# Altium schematic sheet OB_BANK.SchDoc
size 508 x 254 mm; DocumentNumber: 8; SheetNumber: 8; SheetTotal: 13
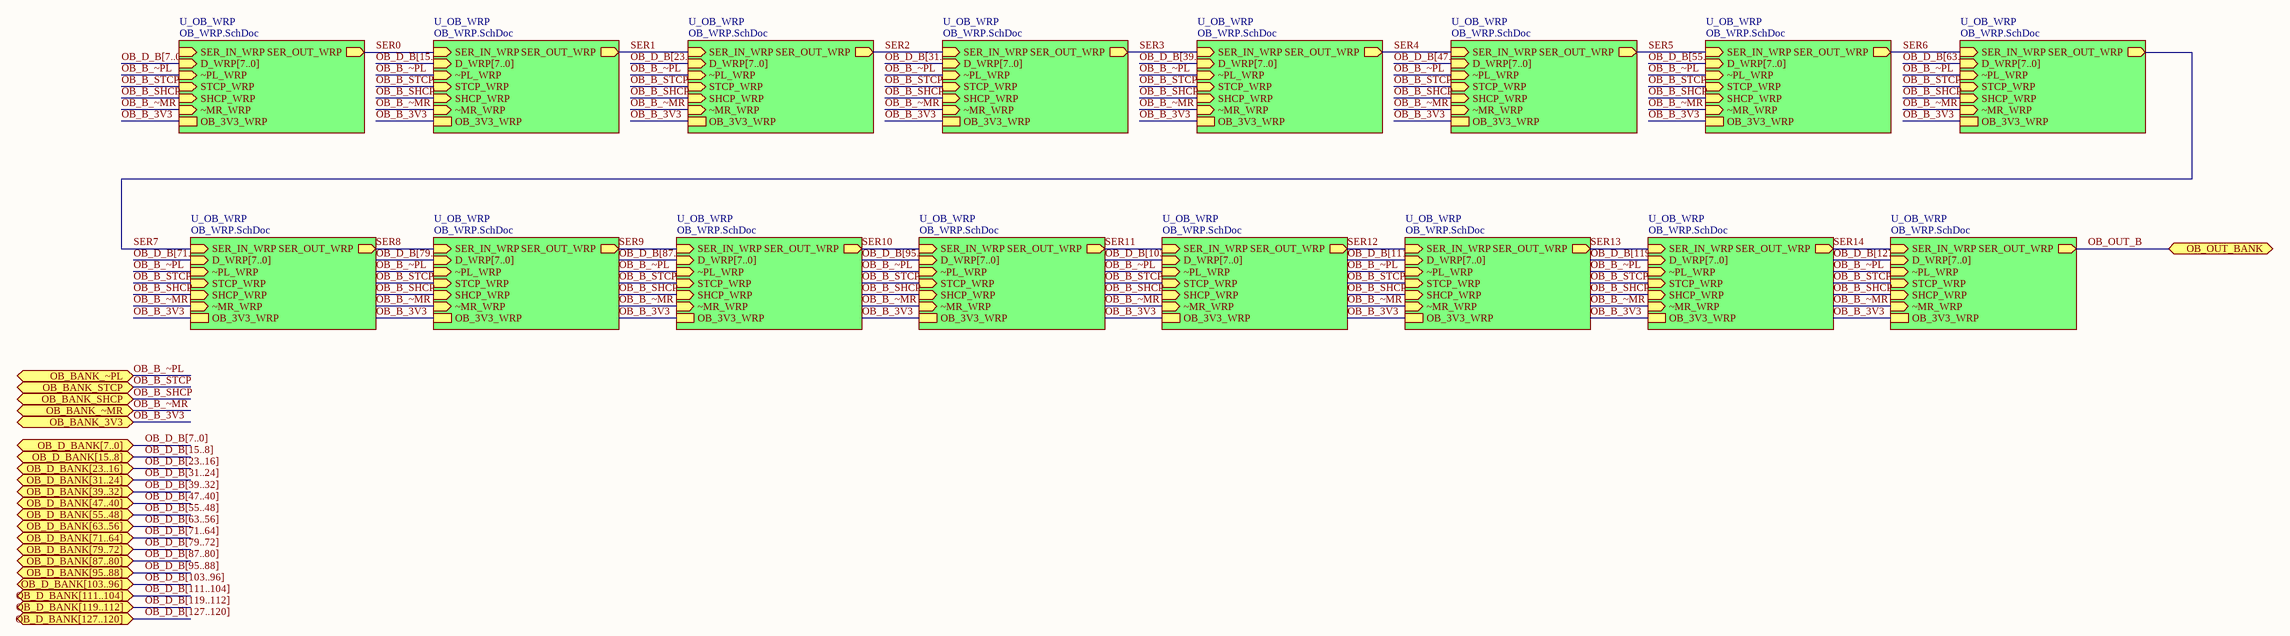
[diagram p0: OB_BANK.SchDoc]

## Sub-sheets
U_OB_WRP = OB_WRP.SchDoc: D_WRP[7..0], SER_OUT_WRP, SER_IN_WRP, ~PL_WRP, STCP_WRP, SHCP_WRP, ~MR_WRP, OB_3V3_WRP
U_OB_WRP = OB_WRP.SchDoc: D_WRP[7..0], SER_OUT_WRP, SER_IN_WRP, ~PL_WRP, STCP_WRP, SHCP_WRP, ~MR_WRP, OB_3V3_WRP
U_OB_WRP = OB_WRP.SchDoc: D_WRP[7..0], SER_OUT_WRP, SER_IN_WRP, ~PL_WRP, STCP_WRP, SHCP_WRP, ~MR_WRP, OB_3V3_WRP
U_OB_WRP = OB_WRP.SchDoc: D_WRP[7..0], SER_OUT_WRP, SER_IN_WRP, ~PL_WRP, STCP_WRP, SHCP_WRP, ~MR_WRP, OB_3V3_WRP
U_OB_WRP = OB_WRP.SchDoc: D_WRP[7..0], SER_OUT_WRP, SER_IN_WRP, ~PL_WRP, STCP_WRP, SHCP_WRP, ~MR_WRP, OB_3V3_WRP
U_OB_WRP = OB_WRP.SchDoc: D_WRP[7..0], SER_OUT_WRP, SER_IN_WRP, ~PL_WRP, STCP_WRP, SHCP_WRP, ~MR_WRP, OB_3V3_WRP
U_OB_WRP = OB_WRP.SchDoc: D_WRP[7..0], SER_OUT_WRP, SER_IN_WRP, ~PL_WRP, STCP_WRP, SHCP_WRP, ~MR_WRP, OB_3V3_WRP
U_OB_WRP = OB_WRP.SchDoc: D_WRP[7..0], SER_OUT_WRP, SER_IN_WRP, ~PL_WRP, STCP_WRP, SHCP_WRP, ~MR_WRP, OB_3V3_WRP
U_OB_WRP = OB_WRP.SchDoc: D_WRP[7..0], SER_OUT_WRP, SER_IN_WRP, ~PL_WRP, STCP_WRP, SHCP_WRP, ~MR_WRP, OB_3V3_WRP
U_OB_WRP = OB_WRP.SchDoc: D_WRP[7..0], SER_OUT_WRP, SER_IN_WRP, ~PL_WRP, STCP_WRP, SHCP_WRP, ~MR_WRP, OB_3V3_WRP
U_OB_WRP = OB_WRP.SchDoc: D_WRP[7..0], SER_OUT_WRP, SER_IN_WRP, ~PL_WRP, STCP_WRP, SHCP_WRP, ~MR_WRP, OB_3V3_WRP
U_OB_WRP = OB_WRP.SchDoc: D_WRP[7..0], SER_OUT_WRP, SER_IN_WRP, ~PL_WRP, STCP_WRP, SHCP_WRP, ~MR_WRP, OB_3V3_WRP
U_OB_WRP = OB_WRP.SchDoc: D_WRP[7..0], SER_OUT_WRP, SER_IN_WRP, ~PL_WRP, STCP_WRP, SHCP_WRP, ~MR_WRP, OB_3V3_WRP
U_OB_WRP = OB_WRP.SchDoc: D_WRP[7..0], SER_OUT_WRP, SER_IN_WRP, ~PL_WRP, STCP_WRP, SHCP_WRP, ~MR_WRP, OB_3V3_WRP
U_OB_WRP = OB_WRP.SchDoc: D_WRP[7..0], SER_OUT_WRP, SER_IN_WRP, ~PL_WRP, STCP_WRP, SHCP_WRP, ~MR_WRP, OB_3V3_WRP
U_OB_WRP = OB_WRP.SchDoc: D_WRP[7..0], SER_OUT_WRP, SER_IN_WRP, ~PL_WRP, STCP_WRP, SHCP_WRP, ~MR_WRP, OB_3V3_WRP

## Ports
OB_BANK_3V3, OB_BANK_SHCP, OB_BANK_STCP, OB_BANK_~MR, OB_BANK_~PL, OB_D_BANK[7..0], OB_D_BANK[15..8], OB_D_BANK[23..16], OB_D_BANK[31..24], OB_D_BANK[39..32], OB_D_BANK[47..40], OB_D_BANK[55..48], OB_D_BANK[63..56], OB_D_BANK[71..64], OB_D_BANK[79..72], OB_D_BANK[87..80], OB_D_BANK[95..88], OB_D_BANK[103..96], OB_D_BANK[111..104], OB_D_BANK[119..112], OB_D_BANK[127..120], OB_OUT_BANK

## Nets
OB_B_3V3: port OB_BANK_3V3, sheet U_OB_WRP/OB_3V3_WRP, sheet U_OB_WRP/OB_3V3_WRP, sheet U_OB_WRP/OB_3V3_WRP, sheet U_OB_WRP/OB_3V3_WRP, sheet U_OB_WRP/OB_3V3_WRP, sheet U_OB_WRP/OB_3V3_WRP, sheet U_OB_WRP/OB_3V3_WRP, sheet U_OB_WRP/OB_3V3_WRP, sheet U_OB_WRP/OB_3V3_WRP, sheet U_OB_WRP/OB_3V3_WRP, sheet U_OB_WRP/OB_3V3_WRP, sheet U_OB_WRP/OB_3V3_WRP, sheet U_OB_WRP/OB_3V3_WRP, sheet U_OB_WRP/OB_3V3_WRP, sheet U_OB_WRP/OB_3V3_WRP, sheet U_OB_WRP/OB_3V3_WRP
OB_B_SHCP: port OB_BANK_SHCP, sheet U_OB_WRP/SHCP_WRP, sheet U_OB_WRP/SHCP_WRP, sheet U_OB_WRP/SHCP_WRP, sheet U_OB_WRP/SHCP_WRP, sheet U_OB_WRP/SHCP_WRP, sheet U_OB_WRP/SHCP_WRP, sheet U_OB_WRP/SHCP_WRP, sheet U_OB_WRP/SHCP_WRP, sheet U_OB_WRP/SHCP_WRP, sheet U_OB_WRP/SHCP_WRP, sheet U_OB_WRP/SHCP_WRP, sheet U_OB_WRP/SHCP_WRP, sheet U_OB_WRP/SHCP_WRP, sheet U_OB_WRP/SHCP_WRP, sheet U_OB_WRP/SHCP_WRP, sheet U_OB_WRP/SHCP_WRP
OB_B_STCP: port OB_BANK_STCP, sheet U_OB_WRP/STCP_WRP, sheet U_OB_WRP/STCP_WRP, sheet U_OB_WRP/STCP_WRP, sheet U_OB_WRP/STCP_WRP, sheet U_OB_WRP/STCP_WRP, sheet U_OB_WRP/STCP_WRP, sheet U_OB_WRP/STCP_WRP, sheet U_OB_WRP/STCP_WRP, sheet U_OB_WRP/STCP_WRP, sheet U_OB_WRP/STCP_WRP, sheet U_OB_WRP/STCP_WRP, sheet U_OB_WRP/STCP_WRP, sheet U_OB_WRP/STCP_WRP, sheet U_OB_WRP/STCP_WRP, sheet U_OB_WRP/STCP_WRP, sheet U_OB_WRP/STCP_WRP
OB_B_~MR: port OB_BANK_~MR, sheet U_OB_WRP/~MR_WRP, sheet U_OB_WRP/~MR_WRP, sheet U_OB_WRP/~MR_WRP, sheet U_OB_WRP/~MR_WRP, sheet U_OB_WRP/~MR_WRP, sheet U_OB_WRP/~MR_WRP, sheet U_OB_WRP/~MR_WRP, sheet U_OB_WRP/~MR_WRP, sheet U_OB_WRP/~MR_WRP, sheet U_OB_WRP/~MR_WRP, sheet U_OB_WRP/~MR_WRP, sheet U_OB_WRP/~MR_WRP, sheet U_OB_WRP/~MR_WRP, sheet U_OB_WRP/~MR_WRP, sheet U_OB_WRP/~MR_WRP, sheet U_OB_WRP/~MR_WRP
OB_B_~PL: port OB_BANK_~PL, sheet U_OB_WRP/~PL_WRP, sheet U_OB_WRP/~PL_WRP, sheet U_OB_WRP/~PL_WRP, sheet U_OB_WRP/~PL_WRP, sheet U_OB_WRP/~PL_WRP, sheet U_OB_WRP/~PL_WRP, sheet U_OB_WRP/~PL_WRP, sheet U_OB_WRP/~PL_WRP, sheet U_OB_WRP/~PL_WRP, sheet U_OB_WRP/~PL_WRP, sheet U_OB_WRP/~PL_WRP, sheet U_OB_WRP/~PL_WRP, sheet U_OB_WRP/~PL_WRP, sheet U_OB_WRP/~PL_WRP, sheet U_OB_WRP/~PL_WRP, sheet U_OB_WRP/~PL_WRP
OB_OUT_B: port OB_OUT_BANK, sheet U_OB_WRP/SER_OUT_WRP
SER0: sheet U_OB_WRP/SER_OUT_WRP, sheet U_OB_WRP/SER_IN_WRP
SER1: sheet U_OB_WRP/SER_OUT_WRP, sheet U_OB_WRP/SER_IN_WRP
SER2: sheet U_OB_WRP/SER_OUT_WRP, sheet U_OB_WRP/SER_IN_WRP
SER3: sheet U_OB_WRP/SER_OUT_WRP, sheet U_OB_WRP/SER_IN_WRP
SER4: sheet U_OB_WRP/SER_OUT_WRP, sheet U_OB_WRP/SER_IN_WRP
SER5: sheet U_OB_WRP/SER_OUT_WRP, sheet U_OB_WRP/SER_IN_WRP
SER6: sheet U_OB_WRP/SER_OUT_WRP, sheet U_OB_WRP/SER_IN_WRP
SER7: sheet U_OB_WRP/SER_OUT_WRP, sheet U_OB_WRP/SER_IN_WRP
SER8: sheet U_OB_WRP/SER_OUT_WRP, sheet U_OB_WRP/SER_IN_WRP
SER9: sheet U_OB_WRP/SER_OUT_WRP, sheet U_OB_WRP/SER_IN_WRP
SER10: sheet U_OB_WRP/SER_OUT_WRP, sheet U_OB_WRP/SER_IN_WRP
SER11: sheet U_OB_WRP/SER_OUT_WRP, sheet U_OB_WRP/SER_IN_WRP
SER12: sheet U_OB_WRP/SER_OUT_WRP, sheet U_OB_WRP/SER_IN_WRP
SER13: sheet U_OB_WRP/SER_OUT_WRP, sheet U_OB_WRP/SER_IN_WRP
SER14: sheet U_OB_WRP/SER_OUT_WRP, sheet U_OB_WRP/SER_IN_WRP

## Buses and harness runs
bus OB_D_B[7..0] = port OB_D_BANK[7..0]
bus OB_D_B[7..0] = sheet U_OB_WRP/D_WRP[7..0]
bus OB_D_B[15..8] = port OB_D_BANK[15..8]
bus OB_D_B[15..8] = sheet U_OB_WRP/D_WRP[7..0]
bus OB_D_B[23..16] = port OB_D_BANK[23..16]
bus OB_D_B[23..16] = sheet U_OB_WRP/D_WRP[7..0]
bus OB_D_B[31..24] = port OB_D_BANK[31..24]
bus OB_D_B[31..24] = sheet U_OB_WRP/D_WRP[7..0]
bus OB_D_B[39..32] = port OB_D_BANK[39..32]
bus OB_D_B[39..32] = sheet U_OB_WRP/D_WRP[7..0]
bus OB_D_B[47..40] = port OB_D_BANK[47..40]
bus OB_D_B[47..40] = sheet U_OB_WRP/D_WRP[7..0]
bus OB_D_B[55..48] = port OB_D_BANK[55..48]
bus OB_D_B[55..48] = sheet U_OB_WRP/D_WRP[7..0]
bus OB_D_B[63..56] = port OB_D_BANK[63..56]
bus OB_D_B[63..56] = sheet U_OB_WRP/D_WRP[7..0]
bus OB_D_B[71..64] = port OB_D_BANK[71..64]
bus OB_D_B[71..64] = sheet U_OB_WRP/D_WRP[7..0]
bus OB_D_B[79..72] = port OB_D_BANK[79..72]
bus OB_D_B[79..72] = sheet U_OB_WRP/D_WRP[7..0]
bus OB_D_B[87..80] = port OB_D_BANK[87..80]
bus OB_D_B[87..80] = sheet U_OB_WRP/D_WRP[7..0]
bus OB_D_B[95..88] = port OB_D_BANK[95..88]
bus OB_D_B[95..88] = sheet U_OB_WRP/D_WRP[7..0]
bus OB_D_B[103..96] = port OB_D_BANK[103..96]
bus OB_D_B[103..96] = sheet U_OB_WRP/D_WRP[7..0]
bus OB_D_B[111..104] = port OB_D_BANK[111..104]
bus OB_D_B[111..104] = sheet U_OB_WRP/D_WRP[7..0]
bus OB_D_B[119..112] = port OB_D_BANK[119..112]
bus OB_D_B[119..112] = sheet U_OB_WRP/D_WRP[7..0]
bus OB_D_B[127..120] = port OB_D_BANK[127..120]
bus OB_D_B[127..120] = sheet U_OB_WRP/D_WRP[7..0]